# EAGLE schematic microstim (EAGLE 6.5.0)
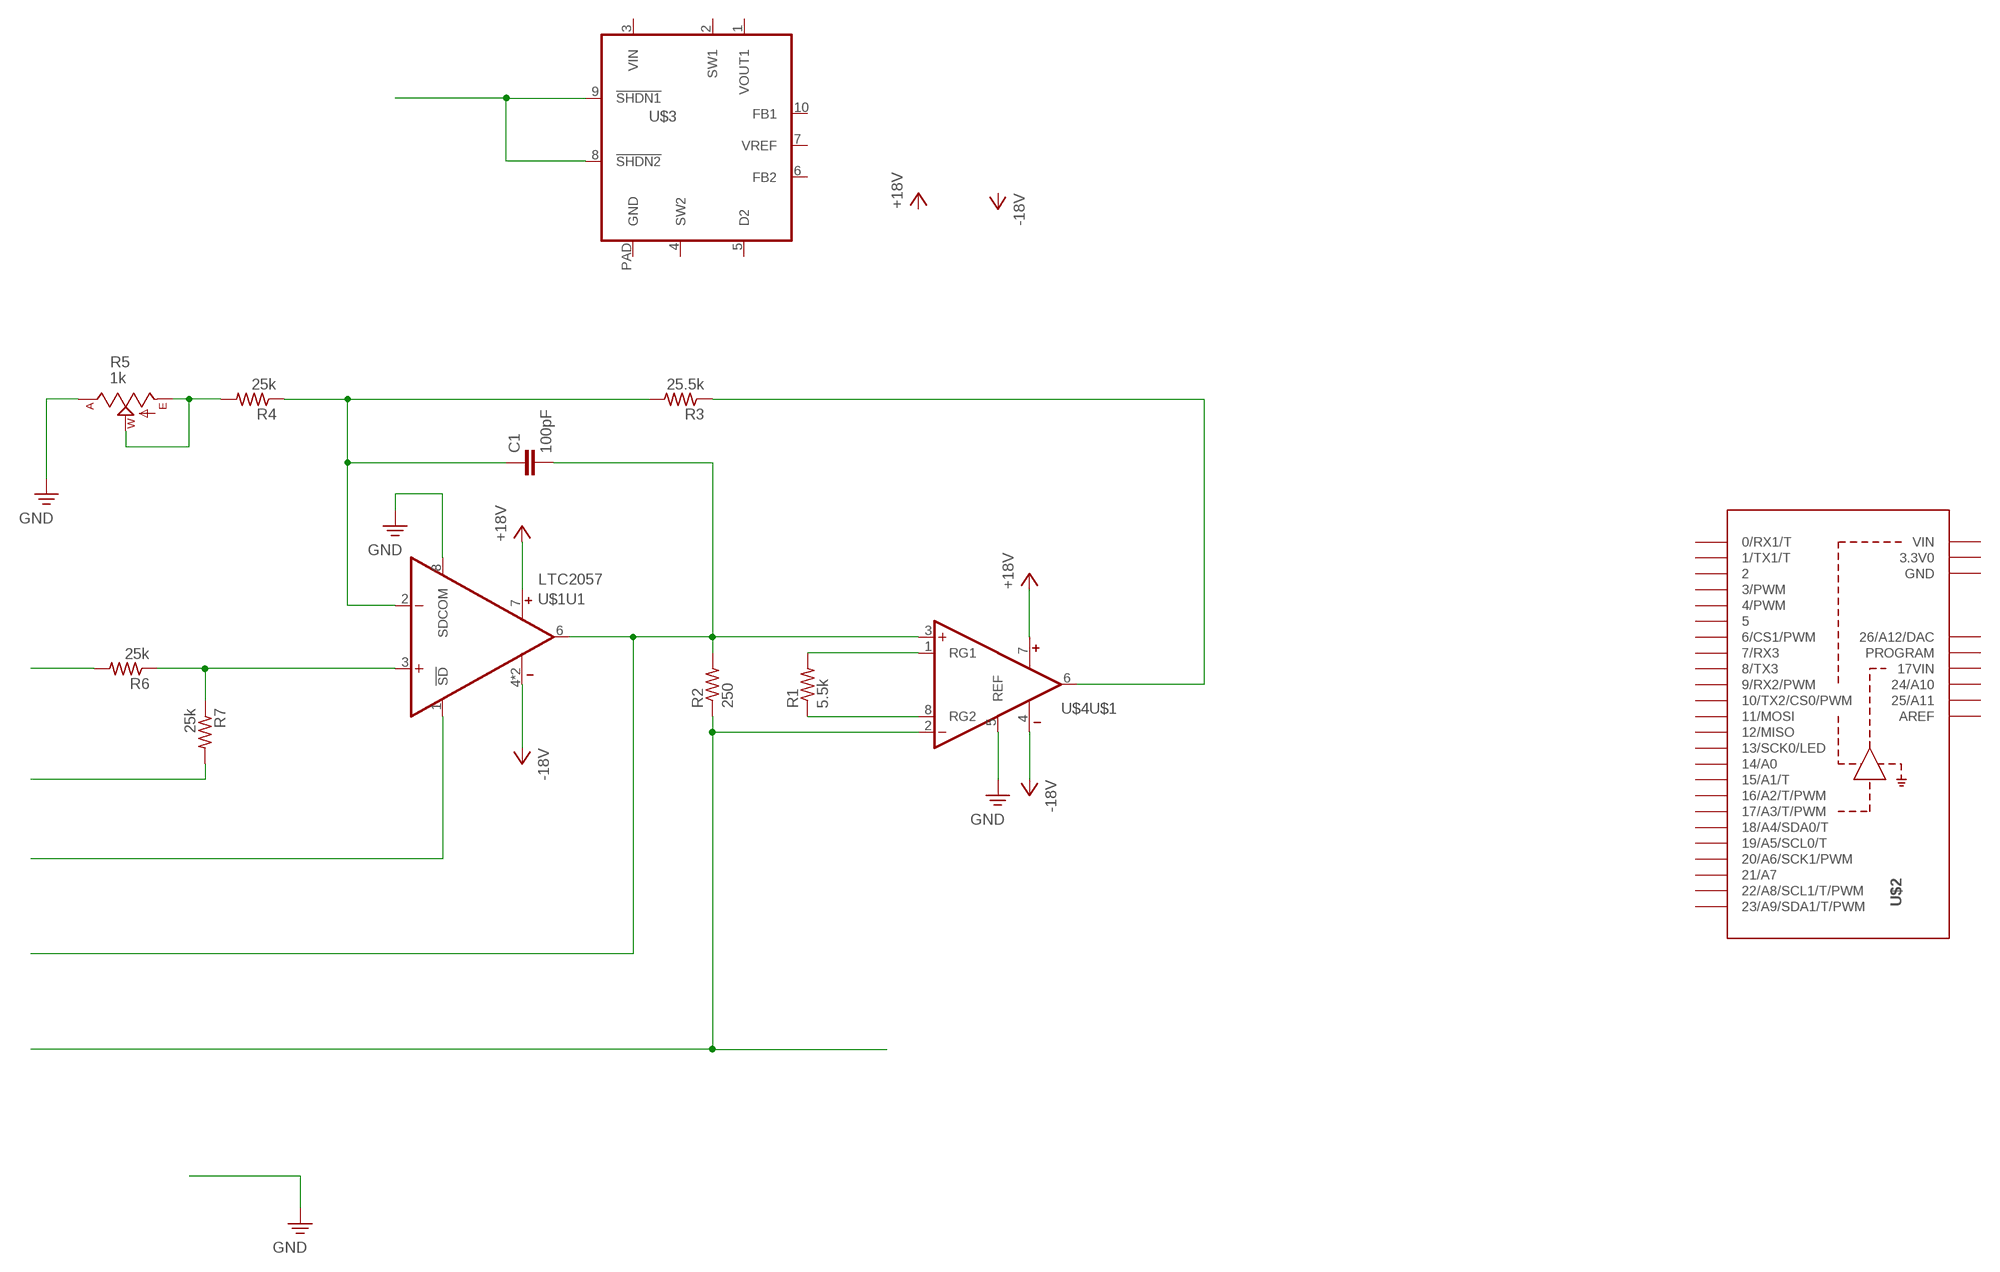
[diagram p0: schematic, sheet 1]

## Parts
C1  100pF  C_0603  [0603]
R1  5.5k  R_0603  [0603]
R2  250  R_0603  [0603]
R3  25.5k  R_0603  [0603]
R4  25k  R_0603  [0603]
R5  1k  TRIM_US-SM-42/43W  [SM-42/43W]
R6  25k  R_0603  [0603]
R7  25k  R_0603  [0603]
U$1  LTC2057  LTC2057_DFN  [DFN83X3]
U$2  TEENSY_LC  [TEENSY_LC]
U$3  LT3463  [DFN103X3]
U$4  LT1167_SOIC  [SOIC127P500X400-8N]

## Nets
!PSD: U$3.8(!SHDN2) U$3.9(!SHDN1)
!SD: U$1.1(U1:!SD)
+18V: U$1.7(V+) U$4.7(V+)
-18V: U$1.4(V-) U$1.PAD(V-) U$4.4(V-)
GND: R5.1(A) U$1.8(U1:SDCOM) U$4.5(U$1:REF)
N$1: R3.1 U$4.6(U$1:OUT)
N$2: C1.1 R3.2 R4.1 U$1.2(U1:-IN)
N$3: R1.2 U$4.1(U$1:RG1)
N$4: R1.1 U$4.8(U$1:RG2)
N$5: C1.2 R2.2 U$1.6(U1:OUT) U$4.3(U$1:+IN)
N$6: R2.1 U$4.2(U$1:-IN)
N$9: R4.2 R5.2(W) R5.3(E)
N$10: R6.1 R7.1 U$1.3(U1:+IN)
VIN: R6.2
VOFFSET: R7.2
Unconnected: U$2.0(0/RX1/T) U$2.1(1/TX1/T) U$2.2 U$2.3(3/PWM) U$2.4(4/PWM) U$2.5 U$2.6(6/CS1/PWM) U$2.7(7/RX3) U$2.8(8/TX3) U$2.9(9/RX2/PWM) U$2.10(10/TX2/CS0/PWM) U$2.11(11/MOSI) U$2.12(12/MISO) U$2.13(13/SCK0/LED) U$2.14/A0 U$2.15/A1(15/A1/T) U$2.16/A2(16/A2/T/PWM) U$2.17/A3(17/A3/T/PWM) U$2.18/A4(18/A4/SDA0/T) U$2.19/A5(19/A5/SCL0/T) U$2.20/A6(20/A6/SCK1/PWM) U$2.21/A7 U$2.22/A8(22/A8/SCL1/T/PWM) U$2.23/A9(23/A9/SDA1/T/PWM) U$2.24(24/A10) U$3.2(SW1) U$3.4(SW2) U$3.5(D2) U$3.6(FB2) U$3.7(VREF) U$3.10(FB1)

## Power pins joined to a net without a drawn wire
3.3V0: U$2.3.3V1(3.3V0) U$2.3.3V(3.3V0)
17VIN: U$2.17VIN
25/A11: U$2.25(25/A11)
26/A12/DAC: U$2.26(26/A12/DAC)
AREF: U$2.AREF
GND: U$2.GND U$2.GND1(GND) U$2.GND2(GND) U$3.PAD(GND)
PROGRAM: U$2.PROGRAM
VIN: U$2.VIN U$3.3(VIN)
VOUT1: U$3.1(VOUT1)

## Library data of the parts
C1 = jonnew:C: Capacitor
R1-R4 R6 R7 = jonnew:R: Resistor; DK: PxxxxHTR-ND; MN: Panasonic; MPN: ERJ-3EKFxxxxV
R5 = jonnew:TRIM_US-: POTENTIOMETER
U$1 = jonnew:LTC2057
U$2 = jonnew:TEENSY_LC
U$3 = jonnew:LT3463
U$4 = jonnew:LT1167